# Altium schematic sheet 220V-12V Power_Interface.SchDoc
size A4
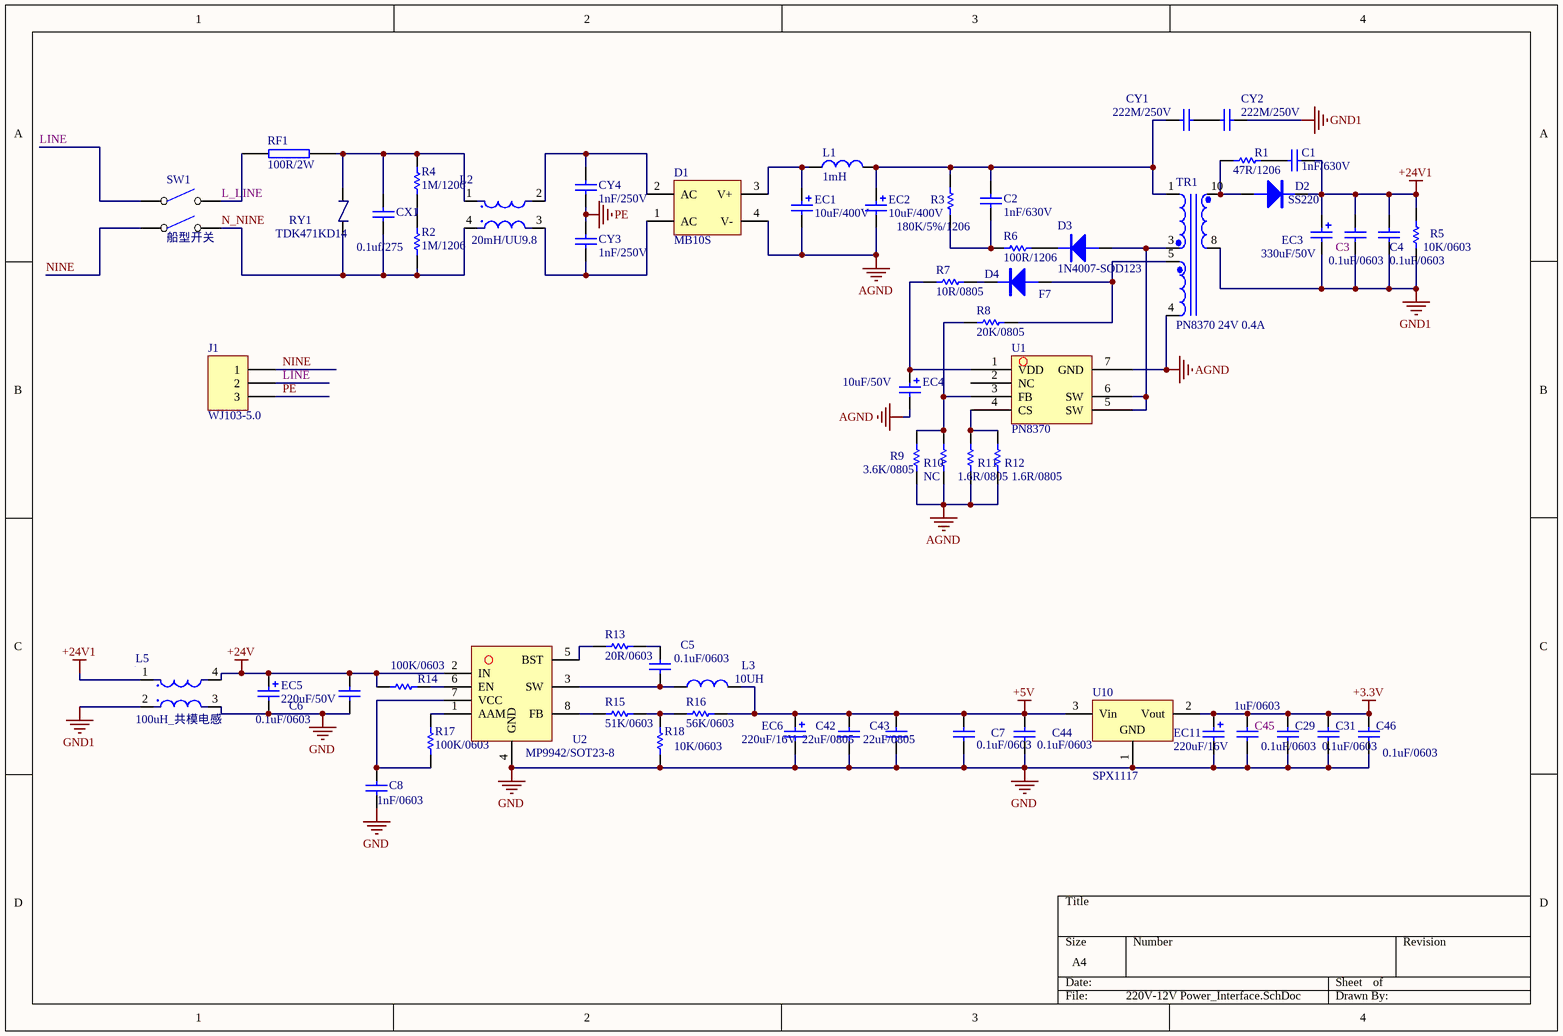
[diagram p0: 220V-12V Power_Interface.SchDoc]

## Parts
C1  1nF/630V  [CAP/SMT/1206C]
C2  1nF/630V  [CAP/SMT/1206C]
C3  0.1uF/0603  [CAP/SMT/0603C]
C4  0.1uF/0603  [CAP/SMT/0603C]
C5  0.1uF/0603  [CAP/SMT/0603C]
C6  0.1uF/0603  [CAP/SMT/0603C]
C7  0.1uF/0603  [CAP/SMT/0603C]
C8  1nF/0603  [CAP/SMT/0603C]
C29  0.1uF/0603  [CAP/SMT/0603C]
C31  0.1uF/0603  [CAP/SMT/0603C]
C42  22uF/0805  [CAP/SMT/0805C]
C43  22uF/0805  [CAP/SMT/0805C]
C44  0.1uF/0603  [CAP/SMT/0603C]
C45  1uF/0603  [CAP/SMT/0603C]
C46  0.1uF/0603  [CAP/SMT/0603C]
CX1  0.1uf/275  [CAP/DIP/0.1uF/250V]
CY1  222M/250V  [CAP/DIP/102M/250V]
CY2  222M/250V  [CAP/DIP/102M/250V]
CY3  1nF/250V  [CAP/DIP/102M/250V]
CY4  1nF/250V  [CAP/DIP/102M/250V]
D1  MB10S  [D/SMT/MD6S-TR]
D2  SS220  [D/SMT/DO-214AC]
D3  1N4007-SOD123  [D/SMT/SOD123]
D4  F7  [D/SMT/DO-214AC]
EC1  10uF/400V  [CAP/DIP/6.8UF/400V/10MM]
EC2  10uF/400V  [CAP/DIP/6.8UF/400V/10MM]
EC3  330uF/50V  [CAP/SMT/220UF/50V]
EC4  10uF/50V  [CAP/DIP/10uF/50V]
EC5  220uF/50V  [CAP/SMT/220UF/50V]
EC6  220uF/16V  [CAP/SMT/220UF/16V]
EC11  220uF/16V  [CAP/SMT/100UF/25V]
J1  WJ103-5.0  [CON/DIP/1×3PIN/5.0MM/WJ103-3P]
L1  1mH  [L/DIP/1mH]
L2  20mH/UU9.8  [L/DIP/20mH/UU9.8]
L3  10UH  [L/SMT/SWPA3015S150MT]
L5  100uH_共模电感  [L/DIP/500uH]
R1  47R/1206  [1206R]
R2  1M/1206  [1206R]
R3  180K/5%/1206  [1206R]
R4  1M/1206  [1206R]
R5  10K/0603  [0603R]
R6  100R/1206  [1206R]
R7  10R/0805  [0805R]
R8  20K/0805  [0805R]
R9  3.6K/0805  [0805R]
R10  NC  [0805R]
R11  1.6R/0805  [0805R]
R12  1.6R/0805  [0805R]
R13  20R/0603  [0603R]
R14  100K/0603  [0603R]
R15  51K/0603  [0603R]
R16  56K/0603  [0603R]
R17  100K/0603  [0603R]
R18  10K/0603  [0603R]
RF1  100R/2W  [FUSE/3.15A]
RY1  TDK471KD14  [RES/RY/TDK471KD14]
SW1  船型开关  [DIP4 - duplicate]
TR1  PN8370 24V 0.4A  [L/TRANS/DIP/PN8370 24V 0.4A]
U1  PN8370  [SOP-7]
U2  MP9942/SOT23-8  [TSOT-8]
U10  SPX1117  [SOT-223]

## Nets
+3.3V: C29.2 C31.2 C45.2 C46.2 EC11.1 U10.2(Vout)
+5V: C7.2 C42.2 C43.2 C44.2 EC6.1 L3.2 R16.2 U10.3(Vin)
+24V: C6.1 EC5.1 L5.4 R14.1 U2.2(IN)
+24V1: C1.2 C3.1 C4.1 D2.1(K) EC3.1 L5.1 R5.2
AGND: D1.4(V-) EC1.2 EC2.2 EC4.2 R9.1 R10.1 R11.1 R12.1 TR1.4 U1.7(GND)
GND: C6.2 C7.1 C8.2 C29.1 C31.1 C42.1 C43.1 C44.1 C45.1 C46.1 EC5.2 EC6.2 EC11.2 L5.3 R18.2 U2.4(GND) U10.1(GND)
GND1: C3.2 C4.2 CY2.2 EC3.2 L5.2 R5.1 TR1.8
PE: CY3.1 CY4.2 J1.3
L_LINE: RF1.2 SW1.1
LINE: J1.2 SW1.2
N_NINE: CX1.2 L2.4 R2.1 RY1.1 SW1.3
NINE: J1.1 SW1.4
NetC1_1: C1.1 R1.2
NetC2_1: C2.1 R3.1 R6.2
NetC2_2: C2.2 CY1.1 EC2.1 L1.2 R3.2 TR1.1
NetC5_1: C5.1 R13.1
NetC5_2: C5.2 L3.1 U2.3(SW)
NetC8_1: C8.1 R17.1 U2.7(VCC)
NetCX1_1: CX1.1 L2.1 R4.2 RF1.1 RY1.2
NetCY1_2: CY1.2 CY2.1
NetCY3_2: CY3.2 D1.1(AC) L2.3
NetCY4_1: CY4.1 D1.2(AC) L2.2
NetD1_3: D1.3(V+) EC1.1 L1.1
NetD2_2: D2.2(A) R1.1 TR1.10
NetD3_1: D3.1(K) R6.1
NetD3_2: D3.2(A) TR1.3 U1.5(SW) U1.6(SW)
NetD4_1: D4.1(K) R7.2
NetD4_2: D4.2(A) R8.2 TR1.5
NetEC4_1: EC4.1 R7.1 U1.1(VDD)
NetR2_2: R2.2 R4.1
NetR8_1: R8.1 R9.2 R10.2 U1.3(FB)
NetR11_2: R11.2 R12.2 U1.4(CS)
NetR13_2: R13.2 U2.5(BST)
NetR14_2: R14.2 U2.6(EN)
NetR15_1: R15.1 U2.8(FB)
NetR15_2: R15.2 R16.1 R18.1
NetR17_2: R17.2 U2.1(AAM)

Not connected (* = marked no-connect by the designer): U1 2(NC)

## Library data of the parts
C1 C2 = CAP/CAP/SMT/1206C
C3-C8 C29 C31 C44-C46 = CAP/CAP/SMT/0603C
C42 C43 = CAP/CAP/SMT/0805C
CX1 = CAP/DIP/0.1uF/275V
CY1-CY4 = CAP/DIP/102M/250V
D1 = D/BRIDGE/SMT/MB10S: D_Bridge
D2 = D/D/SMT/SS210/DO-214
D3 = D/D/SMT/1N4007-SOD123
D4 = D/D/SMT/FFM107/DO-214
EC1 EC2 = CAP/AEC/DIP/6.8uF/400V
EC3 = CAP/AEC/DIP/330uF/25V
EC4 = CAP/AEC/DIP/10uF/50V
EC5 = CAP/AEC/SMT/220uF/50V
EC6 = CAP/AEC/SMT/220uF/16V
EC11 = CAP/AEC/SMT/100uF/25V
J1 = CON/DIP/1X3PIN/WJ103-5.0MM: Connector
L1 = L/L/DIP/JYGX68-1.0mH/300mA: 工字电感
L2 = L/L/DIP/20mH: 共模电感
L3 = L/L/SMT/SWPA3015S150MT: 电感3.0MM*3.0MM*1.5MM
L5 = L/L/DIP/100uH_共模电感: 共模电感
R1-R4 R6 = RES/RES/SMT/1206
R5 R13-R18 = RES/RES/SMT/0603
R7-R12 = RES/RES/SMT/0805
RF1 = FUSE/FUSE/DIP/3.15A
RY1 = RES/RY/DIP/TDK471KD14
SW1 = SWITCH/POWER/DIP/船型开关
TR1 = L/TRANS/DIP/PN8370 24V 0.4A
U1 = IC/POWER/SMT/PN8366/SOP-8
U2 = IC/POWER/SMT/MPS2314/SOT23-8
U10 = IC/POWER/SMT/SPX1117M3-L3.3TR/SOT-223: Manufacturer: Generic Components; Class: Power Management; SubClass: Voltage Regulator; Published: 1999